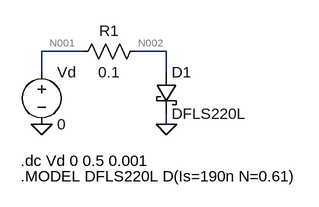
[diagram p0: schematic 5-8-a-1.asc]
5-8-a-1.asc, the LTspice schematic file:
Version 4
SHEET 1 880 680
WIRE 192 144 128 144
WIRE 320 144 272 144
WIRE 128 176 128 144
WIRE 320 176 320 144
WIRE 320 256 320 240
FLAG 320 256 0
FLAG 128 256 0
SYMBOL voltage 128 160 R0
WINDOW 123 0 0 Left 2
WINDOW 39 0 0 Left 2
SYMATTR InstName Vd
SYMATTR Value 0
SYMBOL res 288 128 R90
WINDOW 0 0 56 VBottom 2
WINDOW 3 32 56 VTop 2
SYMATTR InstName R1
SYMATTR Value 0.1
SYMBOL schottky 304 176 R0
SYMATTR InstName D1
SYMATTR Value DFLS220L
SYMATTR Description Diode
SYMATTR Type diode
TEXT 96 336 Left 2 !.MODEL DFLS220L D(Is=190n N=0.61)
TEXT 96 312 Left 2 !.dc Vd 0 0.5 0.001

The netlist it stands for:
* 5-8-a-1.asc
Vd N001 0 0
R1 N002 N001 0.1
D1 N002 0 DFLS220L
.model D D
.lib standard.dio
.MODEL DFLS220L D(Is=190n N=0.61)
.dc Vd 0 0.5 0.001
.backanno
.end

* Results of the author's LTspice run, read from the files saved beside the schematic
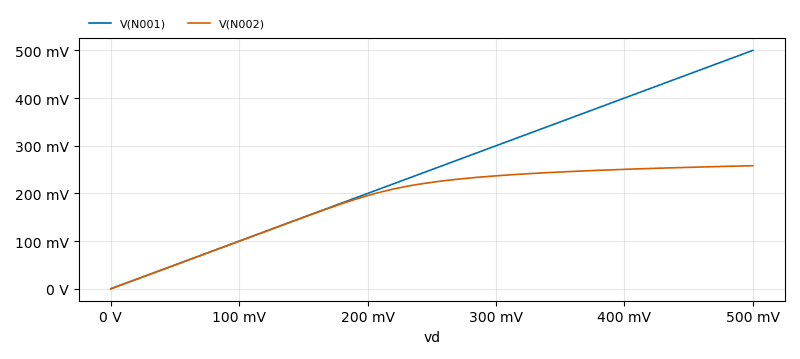
[diagram p1: DC transfer characteristic of 5-8-a-1.asc, plotted from the saved traces]
* DC transfer characteristic, 1 run:
*   V(N001): 0 V at vd=0 V, 500 mV at vd=500 mV, min 0 V, max 500 mV
*   V(N002): 0 V at vd=0 V, 258.1 mV at vd=500 mV, min 0 V, max 258.1 mV